# Altium schematic sheet PWR_NCP59771.SchDoc
size A3
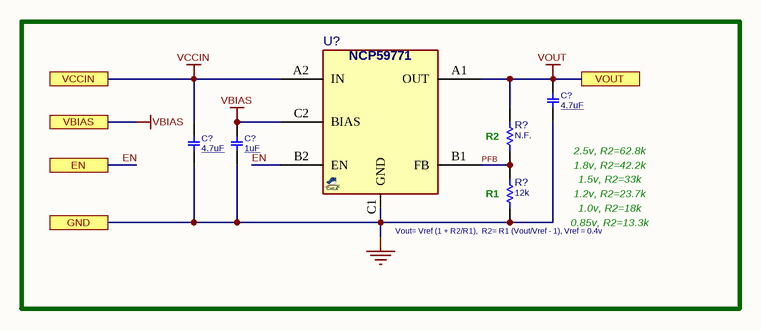
[diagram p0: PWR_NCP59771.SchDoc]

## Parts
(Parts that share a designator on the sheet are numbered #1, #2 ... from top to bottom, then left to right.)
C?#1  4.7uF  [C0402]
C?#2  4.7uF  [C0402]
C?#3  1uF  [C0402]
R?#1  N.F.  [R0603]
R?#2  12k  [R0603]
U?  NCP59771  [BGA40_6_1408]  (value not drawn)

## Ports
EN, GND, VBIAS, VCCIN, VOUT

## Nets
GND: C?#1.2 C?#2.2 C?#3.2 R?#2.1 U?.C1(GND) ; port GND
VBIAS: C?#3.1 U?.C2(BIAS) ; port VBIAS
VCCIN: C?#2.1 U?.A2(IN) ; port VCCIN
VOUT: C?#1.1 R?#1.2 U?.A1(OUT) ; port VOUT
EN: U?.B2(EN) ; port EN
PFB: R?#1.1 R?#2.2 U?.B1(FB)

## Notes on the sheet
- (near R?#2) R1
- (near R?#1) R2
- 2.5v, R2=62.8k
- 1.8v, R2=42.2k
- 1.5v, R2=33k
- 1.2v, R2=23.7k
- Vout= Vref (1 + R2/R1),  R2= R1 (Vout/Vref - 1), Vref = 0.4v
- 1.0v, R2=18k
- 0.85v, R2=13.3k

## Library data of the parts
C?#1 C?#2 = CAP_SMD_MLCC: CAP, MLCC; PARAM: X5R, 20%; PARAM2: 10v; PRICE: 100= 1$; DESC: CAP, MLCC; MANF_P#: -; MANF: -; ASSEMBLY: ASSEMBLY; VALUE: 4.7uF
C?#3 = CAP_SMD_MLCC: CAP, MLCC; PARAM: X5R, 20%; MANF_P#: CC0402KRX5R6BB105; PARAM2: 10v; PRICE: 100= 1$; DESC: CAP, MLCC; MANF: -; ASSEMBLY: ASSEMBLY; VALUE: 1uF
R?#1 R?#2 = RES_SMD: RESISTOR, SMD; PARAM: -W; DESC: DESCRIPTION; DIST#: MOUSER; PARAM2: 1%; MANF_P#: -; MANF: -; ASSEMBLY: ASSEMBLY; PRICE: 100= 0.5$
  R?#1: VALUE: N.F.
  R?#2: VALUE: 12k
U? = VREG_NCP59771_BGA6: REG, Linear, LDO0.05V, 1A; MANF: TI; PARAM: LDO0.05V, 1A, 75dB PSRR@1kHz; MANF_P#: NCP59771AFCRCADJT2G; PARAM2: 0.4~5.5Vin, 0.4~3Vout; ASSEMBLY: ASSEMBLY; PRICE: 1.5$; VALUE: NCP59771